# Altium schematic sheet AFF.SchDoc: Afficheur LCD 16X2
size A4; DocumentNumber: 1; Revision: 1; SheetNumber: 2; SheetTotal: 5; SPICEModelCacheVBWOYBCN: <root> / <DocumentId>VBWOYBCN</DocumentId> / <CacheFrame Number="0"> / <Model Name="res" Kind="MDL"> / <Text>*Default semiconductor resistor / .MODEL RES R()</Text> / </Model> / </CacheFrame> / </root>
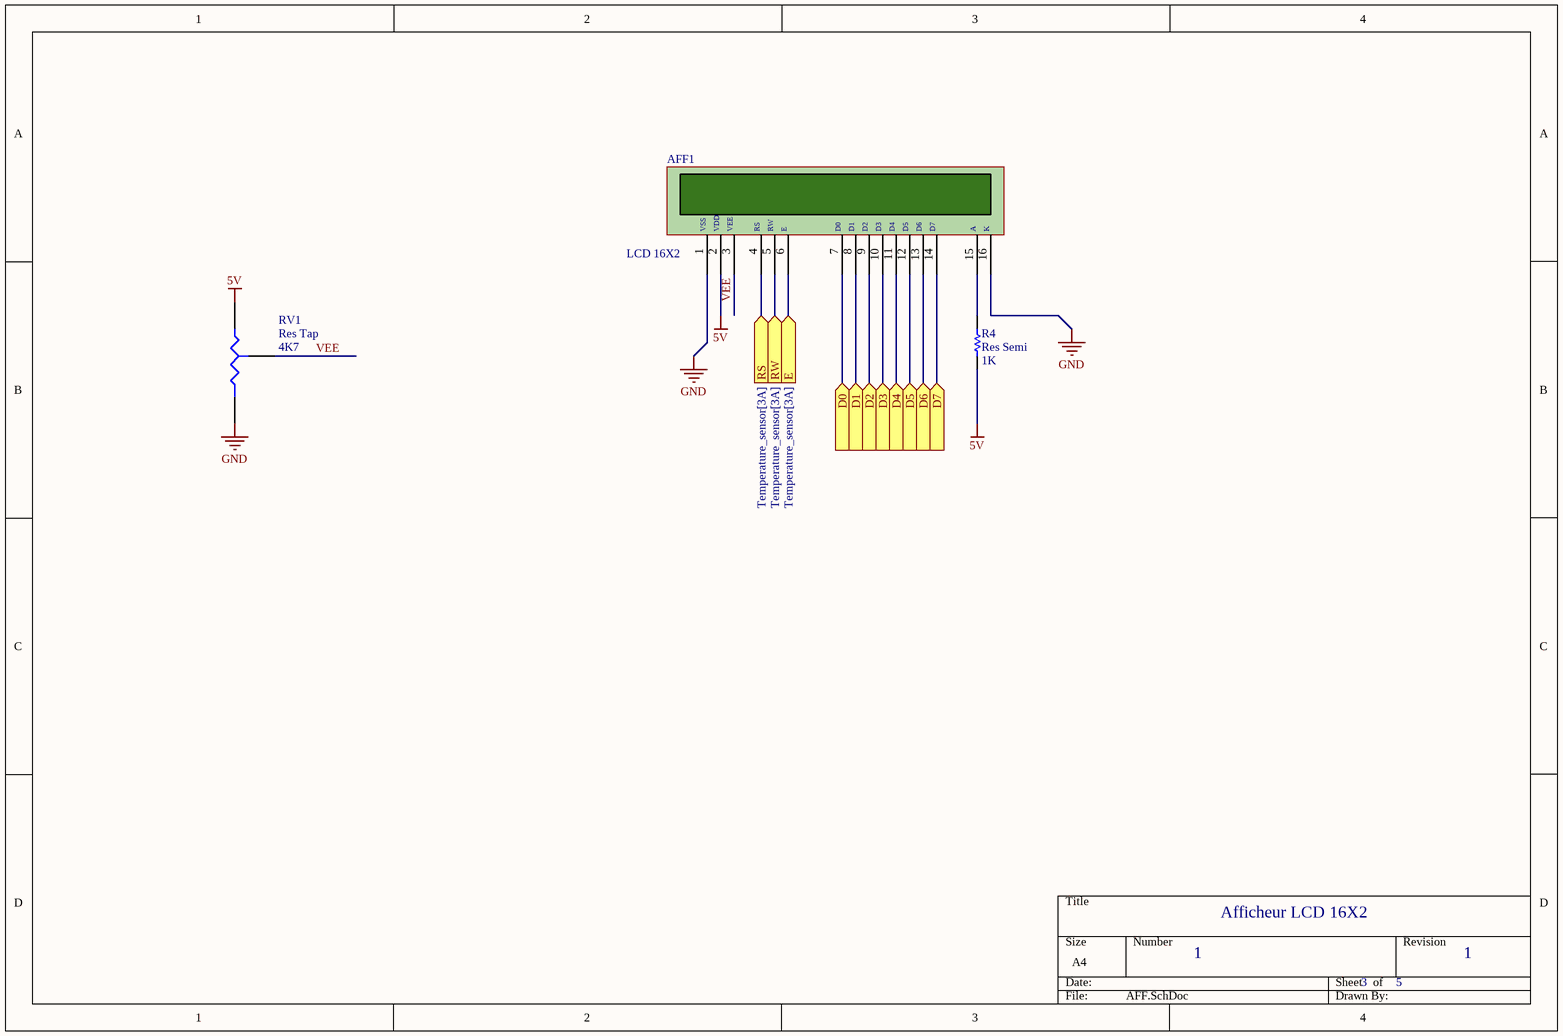
[diagram p0: AFF.SchDoc]

## Parts
AFF1  LCD 16X2  [lcd 16x2]
R4  Res Semi  value 1K  [0805]
RV1  Res Tap  value 4K7  [VR3]

## Ports
D0 (in), D1 (in), D2 (in), D3 (in), D4 (in), D5 (in), D6 (in), D7 (in), E (in, see Temperature_sensor[3A]), RS (in, see Temperature_sensor[3A]), RW (in, see Temperature_sensor[3A])

## Nets
5V: AFF1.2 R4.1 RV1.1(A)
GND: AFF1.1 AFF1.16 RV1.2(B)
D0: AFF1.7 ; port D0
D1: AFF1.8 ; port D1
D2: AFF1.9 ; port D2
D3: AFF1.10 ; port D3
D4: AFF1.11 ; port D4
D5: AFF1.12 ; port D5
D6: AFF1.13 ; port D6
D7: AFF1.14 ; port D7
E: AFF1.6 ; port E
RS: AFF1.4 ; port RS
RW: AFF1.5 ; port RW
VEE: AFF1.3 RV1.3(TAP)
NetAFF1_15: AFF1.15 R4.2

## Notes on the sheet
- Afficheur LCD 16X2
- 1
- 3
- 5
- (in symbol AFF) VSS; VDD; VEE; RS; RW; E; D0; D1; D2; D3; D4; D5; D6; D7; A; K

## Library data of the parts
AFF1 = AFF
R4 = Res Semi: Semiconductor Resistor; Published: 8-Jun-2000; LatestRevisionDate: 17-Jul-2002; LatestRevisionNote: Re-released for DXP Platform.; PackageReference: AXIAL-0.5; Publisher: Altium Limited; PackageDescription: Axial Device, Thru-Hole; 2 Leads; 0.5 in Pin Spacing
RV1 = Res Tap: Tapped Resistor; Sim Note: Enter the Resistance value and the set point into parameter fields.; Set Position: 0.5; Published: 24-Mar-1999; LatestRevisionDate: 17-Jul-2002; LatestRevisionNote: Re-released for DXP Platform.; PackageReference: VR3; Publisher: Altium Limited; PackageDescription: Variable Resistor, Thru-Hole; 3 Leads